# Altium project AES_SSI2130.PrjPcb
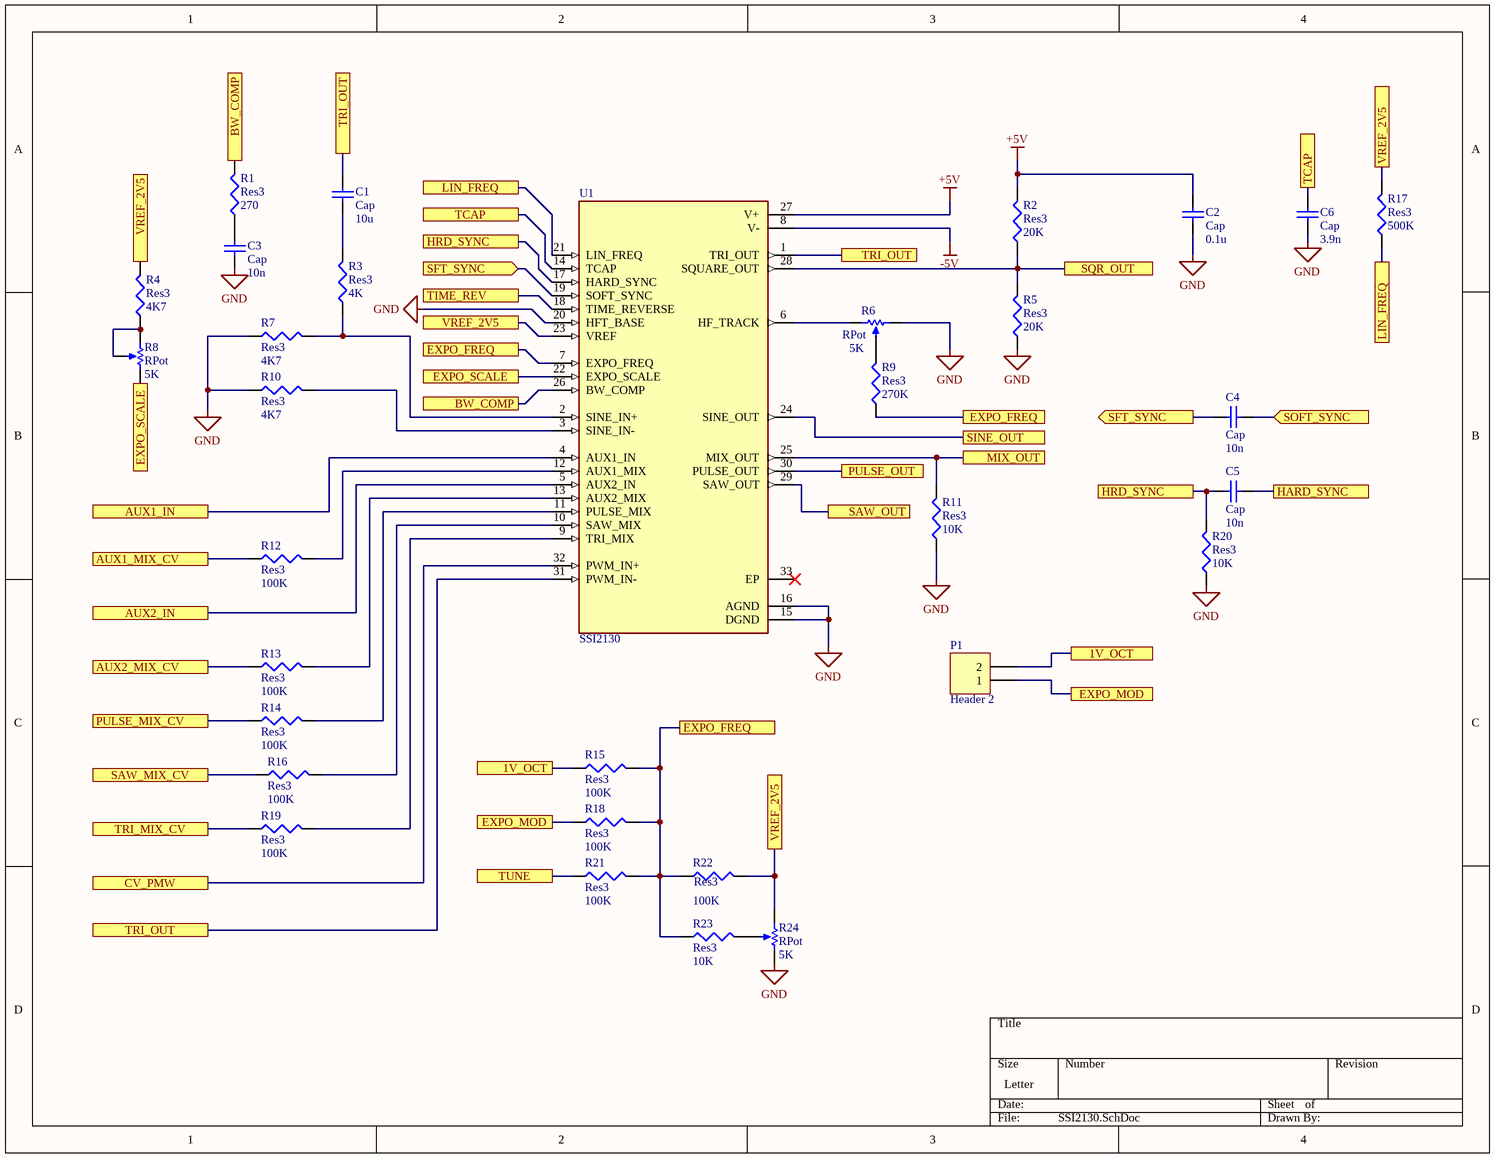
[diagram p0: SSI2130.SchDoc]
2 sheets, 40 parts. Net scope: flat (ports and power ports of the same name join across sheets).
Sheets:
  SSI2130.SchDoc
  power.SchDoc

## Sheet SSI2130.SchDoc
size Letter

### Parts
C1  Cap  value 10u  [RAD-0.3]
C2  Cap  value 0.1u  [RAD-0.3]
C3  Cap  value 10n  [RAD-0.3]
C4  Cap  value 10n  [RAD-0.3]
C5  Cap  value 10n  [RAD-0.3]
C6  Cap  value 3.9n  [RAD-0.3]
P1  Header 2  [HDR1X2]
R1  Res3  value 270  [J1-0603]
R2  Res3  value 20K  [J1-0603]
R3  Res3  value 4K  [J1-0603]
R4  Res3  value 4K7  [J1-0603]
R5  Res3  value 20K  [J1-0603]
R6  RPot  value 5K  [VR5]
R7  Res3  value 4K7  [J1-0603]
R8  RPot  value 5K  [VR5]
R9  Res3  value 270K  [J1-0603]
R10  Res3  value 4K7  [J1-0603]
R11  Res3  value 10K  [J1-0603]
R12  Res3  value 100K  [J1-0603]
R13  Res3  value 100K  [J1-0603]
R14  Res3  value 100K  [J1-0603]
R15  Res3  value 100K  [J1-0603]
R16  Res3  value 100K  [J1-0603]
R17  Res3  value 500K  [J1-0603]
R18  Res3  value 100K  [J1-0603]
R19  Res3  value 100K  [J1-0603]
R20  Res3  value 10K  [J1-0603]
R21  Res3  value 100K  [J1-0603]
R22  Res3  value 100K  [J1-0603]
R23  Res3  value 10K  [J1-0603]
R24  RPot  value 5K  [VR5]
U1  SSI2130  [QFN40P400X400X90-33N]

### Ports
1V_OCT, AUX1_IN, AUX1_MIX_CV, AUX2_IN, AUX2_MIX_CV, BW_COMP, CV_PMW, EXPO_FREQ, EXPO_MOD, EXPO_SCALE, HARD_SYNC, HRD_SYNC, LIN_FREQ, MIX_OUT, PULSE_MIX_CV, PULSE_OUT, SAW_MIX_CV, SAW_OUT, SFT_SYNC (in), SFT_SYNC (out), SINE_OUT, SOFT_SYNC (in), SQR_OUT, TCAP, TIME_REV, TRI_MIX_CV, TRI_OUT, TUNE, VREF_2V5

### Nets
+5V: C2.2 R2.2 U1.27(V+)
-5V: U1.8(V-)
GND: C2.1 C3.1 C6.1 R5.1 R6.2(BOT) R7.1 R10.1 R11.1 R20.1 R24.2(BOT) U1.15(DGND) U1.16(AGND) U1.20(HFT_BASE)
NetC1_1: C1.1 R3.2
NetC1_2: C1.2 U1.1(TRI_OUT) U1.31(PWM_IN-) ; port TRI_OUT
NetC3_2: C3.2 R1.1
NetC4_1: C4.1 U1.19(SOFT_SYNC) ; port SFT_SYNC
NetC4_2: C4.2 ; port SOFT_SYNC
NetC5_1: C5.1 R20.2 U1.17(HARD_SYNC) ; port HRD_SYNC
NetC5_2: C5.2 ; port HARD_SYNC
NetC6_2: C6.2 U1.14(TCAP) ; port TCAP
NetP1_1: P1.1 R18.1 ; port EXPO_MOD
NetP1_2: P1.2 R15.1 ; port 1V_OCT
NetR1_2: R1.2 U1.26(BW_COMP) ; port BW_COMP
NetR2_1: R2.1 R5.2 U1.28(SQUARE_OUT) ; port SQR_OUT
NetR3_1: R3.1 R7.2 U1.2(SINE_IN+)
NetR4_1: R4.1 R8.1(TOP) R8.3(TAP)
NetR4_2: R4.2 R17.2 R22.2 R24.1(TOP) U1.23(VREF) ; port VREF_2V5
NetR6_1: R6.1(TOP) U1.6(HF_TRACK)
NetR6_3: R6.3(TAP) R9.2
NetR8_2: R8.2(BOT) U1.22(EXPO_SCALE) ; port EXPO_SCALE
NetR9_1: R9.1 R15.2 R18.2 R21.2 R22.1 R23.1 U1.7(EXPO_FREQ) ; port EXPO_FREQ
NetR10_2: R10.2 U1.3(SINE_IN-)
NetR11_2: R11.2 U1.25(MIX_OUT) ; port MIX_OUT
NetR12_1: R12.1 ; port AUX1_MIX_CV
NetR12_2: R12.2 U1.12(AUX1_MIX)
NetR13_1: R13.1 ; port AUX2_MIX_CV
NetR13_2: R13.2 U1.13(AUX2_MIX)
NetR14_1: R14.1 ; port PULSE_MIX_CV
NetR14_2: R14.2 U1.11(PULSE_MIX)
NetR16_1: R16.1 ; port SAW_MIX_CV
NetR16_2: R16.2 U1.10(SAW_MIX)
NetR17_1: R17.1 U1.21(LIN_FREQ) ; port LIN_FREQ
NetR19_1: R19.1 ; port TRI_MIX_CV
NetR19_2: R19.2 U1.9(TRI_MIX)
NetR21_1: R21.1 ; port TUNE
NetR23_2: R23.2 R24.3(TAP)
NetU1_4: U1.4(AUX1_IN) ; port AUX1_IN
NetU1_5: U1.5(AUX2_IN) ; port AUX2_IN
NetU1_18: U1.18(TIME_REVERSE) ; port TIME_REV
NetU1_24: U1.24(SINE_OUT) ; port SINE_OUT
NetU1_29: U1.29(SAW_OUT) ; port SAW_OUT
NetU1_30: U1.30(PULSE_OUT) ; port PULSE_OUT
NetU1_32: U1.32(PWM_IN+) ; port CV_PMW

Not connected (* = marked no-connect by the designer): U1 33(EP)*

### Library data of the parts
C1-C6 = Cap: Capacitor; Published: 8-Jun-2000; LatestRevisionDate: 17-Jul-2002; LatestRevisionNote: Re-released for DXP Platform.; PackageReference: RAD-0.3; Publisher: Altium Limited; PackageDescription: Radial Cap, Thru-Hole; 2 Leads; 0.3 in Pin Spacing
P1 = Header 2: Header, 2-Pin; LatestRevisionDate: 17-Jul-2002; LatestRevisionNote: Re-released for DXP Platform.; Publisher: Altium Limited
R1-R5 R7 R9-R23 = Res3: Resistor; Published: 8-Jun-2000; LatestRevisionDate: 29-May-2009; LatestRevisionNote: IPC-7351 Footprint Added.; PackageReference: J1-0603; Publisher: Altium Limited; PackageDescription: Chip Resistor
R6 R8 R24 = RPot: Potentiometer; Sim Note: Enter the Resistance value and the set point into parameter fields.; Set Position: 0.5; Published: 8-Jun-2000; LatestRevisionDate: 17-Jul-2002; LatestRevisionNote: Re-released for DXP Platform.; PackageReference: VR5; Publisher: Altium Limited; PackageDescription: Variable Resistor, Thru-Hole; 3 Leads
U1 = SSI2130: Voltage controlled oscillator subsystem for high-performance electronic musical instruments; MF: Sound Semiconductor; Check_prices: https://www.snapeda.com/parts/SSI2130/Sound%20Semiconductor/view-part/5718733/?ref=eda; SnapEDA_Link: https://www.snapeda.com/parts/SSI2130/Sound%20Semiconductor/view-part/5718733/?ref=snap; Price: None; MP: SSI2130; Value: *; Availability: Unavailable; Package: Package

## Sheet power.SchDoc
size Letter
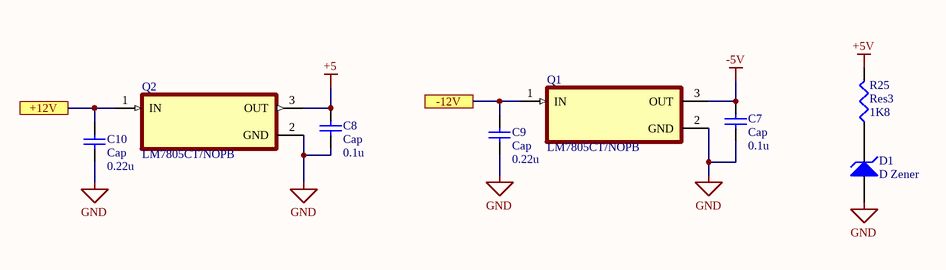
[diagram p1: power.SchDoc]

### Parts
C7  Cap  value 0.1u  [RAD-0.3]
C8  Cap  value 0.1u  [RAD-0.3]
C9  Cap  value 0.22u  [RAD-0.3]
C10  Cap  value 0.22u  [RAD-0.3]
D1  D Zener  [DIODE-0.7]
Q1  LM7805CT/NOPB  [TO254P1054X470X1955-3]
Q2  LM7805CT/NOPB  [TO254P1054X470X1955-3]
R25  Res3  value 1K8  [J1-0603]

### Ports
+12V, -12V

### Nets
+5: C8.2 Q2.3(OUT)
+5V: R25.2
-5V: C7.2 Q1.3(OUT)
GND: C7.1 C8.1 C9.1 C10.1 D1.1(A) Q1.2(GND) Q2.2(GND)
NetC9_2: C9.2 Q1.1(IN) ; port -12V
NetC10_2: C10.2 Q2.1(IN) ; port +12V
NetD1_2: D1.2(K) R25.1

### Library data of the parts
C7-C10 = Cap: Capacitor; Published: 8-Jun-2000; LatestRevisionDate: 17-Jul-2002; LatestRevisionNote: Re-released for DXP Platform.; PackageReference: RAD-0.3; Publisher: Altium Limited; PackageDescription: Radial Cap, Thru-Hole; 2 Leads; 0.3 in Pin Spacing
D1 = D Zener: Zener Diode; Published: 8-Jun-2000; LatestRevisionDate: 17-Jul-2002; LatestRevisionNote: Re-released for DXP Platform.; PackageReference: DIODE-0.7; Publisher: Altium Limited; PackageDescription: Diode, Thru-Hole; 2 Leads; 0.7 in Pin Spacing
Q1 Q2 = LM7805CT/NOPB: 1.5-A, 30-V, linear voltage regulator 3-TO-220 0 to 125; MF: Texas Instruments; Package: TO-220-3 Texas Instruments; Texas_Instruments-Purchase-URL: https://snapeda.com/shop?store=Texas+Instruments&id=6627; Value: *; Price: None; MP: LM7805CT/NOPB; Availability: Unavailable; SnapEDA_Link: https://www.snapeda.com/parts/LM7805CT/NOPB/Texas%20Instruments/view-part/6627/?ref=snap
R25 = Res3: Resistor; Published: 8-Jun-2000; LatestRevisionDate: 29-May-2009; LatestRevisionNote: IPC-7351 Footprint Added.; PackageReference: J1-0603; Publisher: Altium Limited; PackageDescription: Chip Resistor

## Nets that join several sheets
+5V: SSI2130 (C2.2 R2.2 U1.27), power (R25.2)
-5V: SSI2130 (U1.8), power (C7.2 Q1.3)
GND: SSI2130 (13 pins), power (7 pins)